# Altium project Casino.PrjPcb
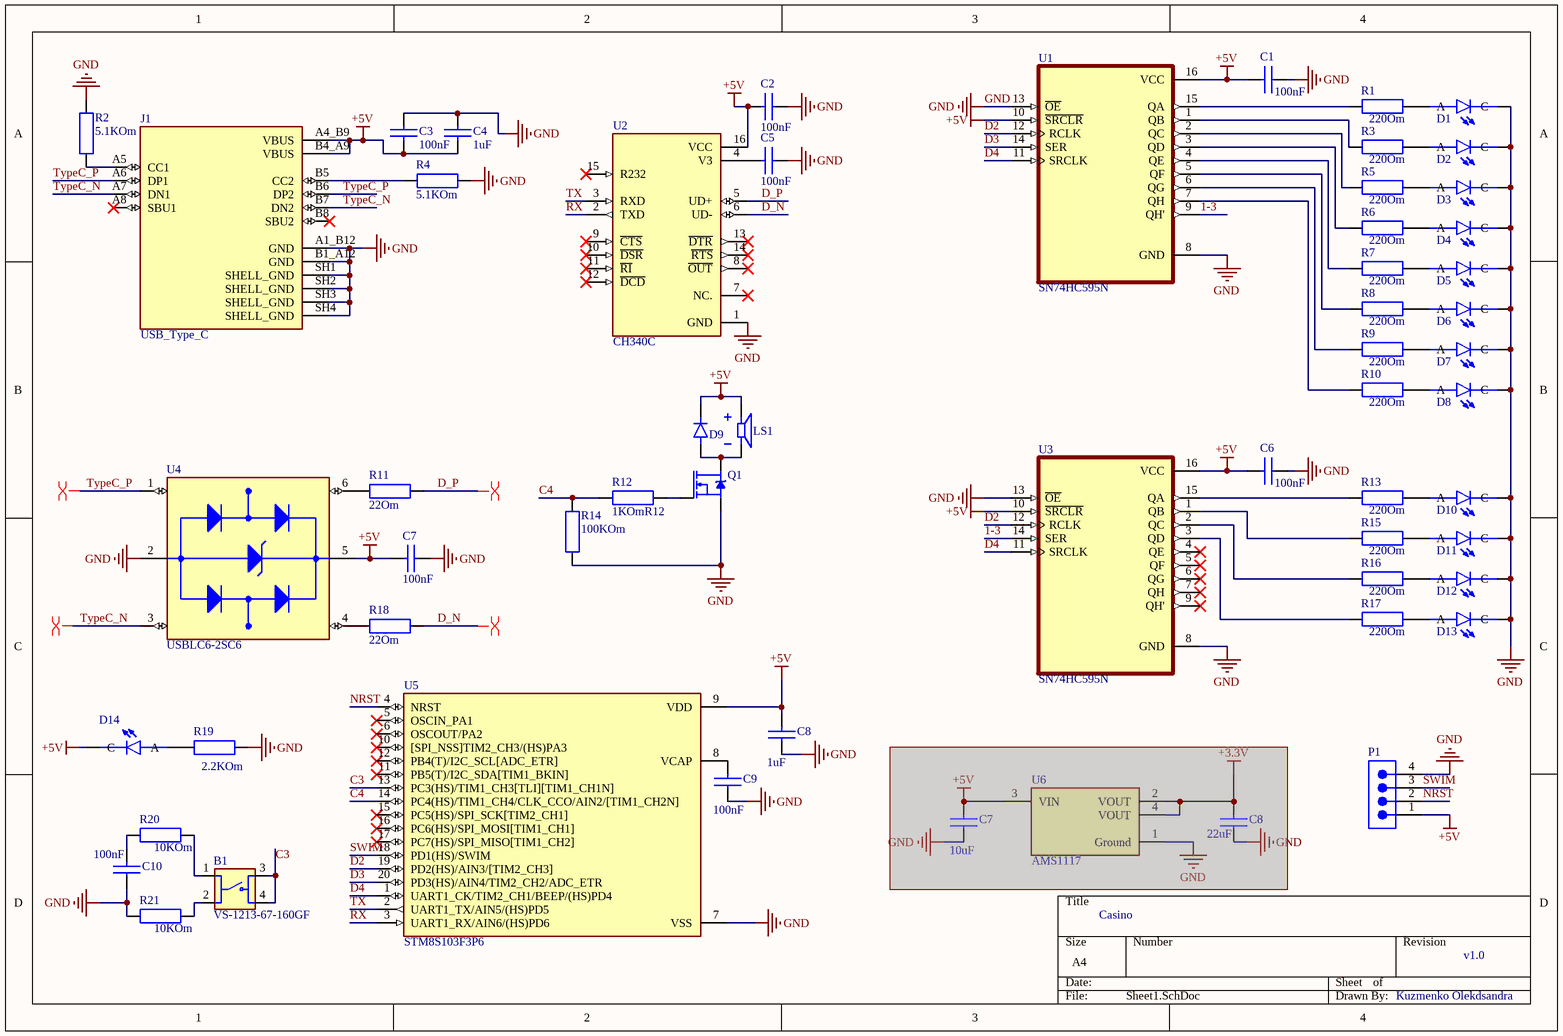
[diagram p0: Sheet1.SchDoc]
1 sheet, 58 parts. Net scope: global (net labels, ports and power ports of the same name join across sheets).
Board file: PCB1.PcbDoc

## Sheet Sheet1.SchDoc
size A4; SheetNumber: 1; SheetTotal: 1

### Parts
(Parts that share a designator on the sheet are numbered #1, #2 ... from top to bottom, then left to right.)
B1  VS-1213-67-160GF  [Button]
C1  value 100nF  [Cap_1206]  (hidden comment: Cap_1206)
C2  value 100nF  [Cap_1206]  (hidden comment: Cap_1206)
C3  value 100nF  [Cap_1206]  (hidden comment: Cap_1206)
C4  value 1uF  [Cap_1206]  (hidden comment: Cap_1206)
C5  value 100nF  [Cap_1206]  (hidden comment: Cap_1206)
C6  100nF  [Cap_1206]
C7#1  value 100nF  [Cap_1206]  (hidden comment: Cap_1206)
C7#2  value 10uF  [Cap_1206]  (hidden comment: Cap_1206)  (masked out: inside a compile mask, not in the netlist)
C8#1  value 1uF  [Cap_1206]  (hidden comment: Cap_1206)
C8#2  value 22uF  [Cap_1206]  (hidden comment: Cap_1206)  (masked out: inside a compile mask, not in the netlist)
C9  value 100nF  [Cap_1206]  (hidden comment: Cap_1206)
C10  value 100nF  [Cap_1206]  (hidden comment: Cap_1206)
D1  Diode  [Diode_Green]  (value not drawn)
D2  Diode  [Diode_Green]  (value not drawn)
D3  Diode  [Diode_Green]  (value not drawn)
D4  Diode  [Diode_Green]  (value not drawn)
D5  Diode  [Diode_Green]  (value not drawn)
D6  Diode  [Diode_Green]  (value not drawn)
D7  Diode  [Diode_Green]  (value not drawn)
D8  Diode  [Diode_Green]  (value not drawn)
D9  Diode standart  [Diode standart]  (value not drawn)
D10  Diode  [Diode_Green]  (value not drawn)
D11  Diode  [Diode_Green]  (value not drawn)
D12  Diode  [Diode_Green]  (value not drawn)
D13  Diode  [Diode_Green]  (value not drawn)
D14  Diode  [Diode_Green]  (value not drawn)
J1  USB_Type_C  [USB_Type_C]
LS1  Speaker  [Speaker]  (value not drawn)
P1  Conector_4pin  [Conector_4pins]  (value not drawn)
Q1  IRLR2905TRPBF  [IRLR2905TRPBF]  (value not drawn)
R1  value 220Om  [Res_1206]  (hidden comment: Res_1206)
R2  value 5.1KOm  [Res_1206]  (hidden comment: Res_1206)
R3  value 220Om  [Res_1206]  (hidden comment: Res_1206)
R4  value 5.1KOm  [Res_1206]  (hidden comment: Res_1206)
R5  value 220Om  [Res_1206]  (hidden comment: Res_1206)
R6  value 220Om  [Res_1206]  (hidden comment: Res_1206)
R7  value 220Om  [Res_1206]  (hidden comment: Res_1206)
R8  value 220Om  [Res_1206]  (hidden comment: Res_1206)
R9  value 220Om  [Res_1206]  (hidden comment: Res_1206)
R10  value 220Om  [Res_1206]  (hidden comment: Res_1206)
R11  value 22Om  [Res_1206]  (hidden comment: Res_1206)
R12  value 1KOmR12  [Res_1206]  (hidden comment: Res_1206)
R13  value 220Om  [Res_1206]  (hidden comment: Res_1206)
R14  value 100KOm  [Res_1206]  (hidden comment: Res_1206)
R15  value 220Om  [Res_1206]  (hidden comment: Res_1206)
R16  value 220Om  [Res_1206]  (hidden comment: Res_1206)
R17  value 220Om  [Res_1206]  (hidden comment: Res_1206)
R18  value 22Om  [Res_1206]  (hidden comment: Res_1206)
R19  value 2.2KOm  [Res_1206]  (hidden comment: Res_1206)
R20  value 10KOm  [Res_1206]  (hidden comment: Res_1206)
R21  value 10KOm  [Res_1206]  (hidden comment: Res_1206)
U1  SN74HC595N  [SN74HC595N]
U2  CH340С  [CH340С]
U3  SN74HC595N  [SN74HC595N]
U4  USBLC6-2SC6  [USBLC6-2SC6]
U5  STM8S103F3P6  [SOP65P640X120-20N]
U6  AMS1117  [AMS1117_SOT223]  (masked out: inside a compile mask, not in the netlist)

### Nets
+5V: C1.2 C2.2 C3.2 C4.2 C6.2 C7#1.2 C8#1.2 D9.C(K) D14.C J1.A4_B9(VBUS) J1.B4_A9(VBUS) LS1.P P1.1 U1.10(~{SRCLR}) U1.16(VCC) U2.16(VCC) U3.10(~{SRCLR}) U3.16(VCC) U4.5(VBUS) U5.9(VDD)
GND: C1.1 C2.1 C3.1 C4.1 C5.1 C6.1 C7#1.1 C8#1.1 C9.1 C10.1 D1.C D2.C D3.C D4.C D5.C D6.C D7.C D8.C D10.C D11.C D12.C D13.C J1.A1_B12(GND) J1.B1_A12(GND) J1.SH1(SHELL_GND) J1.SH2(SHELL_GND) J1.SH3(SHELL_GND) J1.SH4(SHELL_GND) P1.4 Q1.3(S) R2.2 R4.1 R14.1 R19.2 R21.1 U1.8(GND) U1.13(~{OE}) U2.1(GND) U3.8(GND) U3.13(~{OE}) U4.2(GND) U5.7(VSS)
1-3: U1.9(QH') U3.14(SER)
C3: B1.3 B1.4 U5.13(PC3(HS)/TIM1_CH3[TLI][TIM1_CH1N])
C4: R12.2 R14.2 U5.14(PC4(HS)/TIM1_CH4/CLK_CCO/AIN2/[TIM1_CH2N])
D2: U1.12(RCLK) U3.12(RCLK) U5.19(PD2(HS)/AIN3/[TIM2_CH3])
D3: U1.14(SER) U5.20(PD3(HS)/AIN4/TIM2_CH2/ADC_ETR)
D4: U1.11(SRCLK) U3.11(SRCLK) U5.1(UART1_CK/TIM2_CH1/BEEP/(HS)PD4)
D_N: R18.1 U2.6(UD-)
D_P: R11.1 U2.5(UD+)
NRST: P1.2 U5.4(NRST)
RX: U2.2(TXD) U5.3(UART1_RX/AIN6/(HS)PD6)
SWIM: P1.3 U5.18(PD1(HS)/SWIM)
TX: U2.3(RXD) U5.2(UART1_TX/AIN5/(HS)PD5)
TypeC_N: J1.A7(DN1) J1.B7(DN2) U4.3(I/O2_IN)
TypeC_P: J1.A6(DP1) J1.B6(DP2) U4.1(I/O1_IN)
NetB1_1: B1.1 R20.2
NetB1_2: B1.2 R21.2
NetC5_2: C5.2 U2.4(V3)
NetC9_2: C9.2 U5.8(VCAP)
NetC10_2: C10.2 R20.1
NetD1_A: D1.A R1.2
NetD2_A: D2.A R3.2
NetD3_A: D3.A R5.2
NetD4_A: D4.A R6.2
NetD5_A: D5.A R7.2
NetD6_A: D6.A R8.2
NetD7_A: D7.A R9.2
NetD8_A: D8.A R10.2
NetD9_A: D9.A LS1.N Q1.2(D) Q1.PAD(D)
NetD10_A: D10.A R13.2
NetD11_A: D11.A R15.2
NetD12_A: D12.A R16.2
NetD13_A: D13.A R17.2
NetD14_A: D14.A R19.1
NetJ1_A5: J1.A5(CC1) R2.1
NetJ1_B5: J1.B5(CC2) R4.2
NetQ1_1: Q1.1(G) R12.1
NetR1_1: R1.1 U1.15(QA)
NetR3_1: R3.1 U1.1(QB)
NetR5_1: R5.1 U1.2(QC)
NetR6_1: R6.1 U1.3(QD)
NetR7_1: R7.1 U1.4(QE)
NetR8_1: R8.1 U1.5(QF)
NetR9_1: R9.1 U1.6(QG)
NetR10_1: R10.1 U1.7(QH)
NetR11_2: R11.2 U4.6(I/O1_OUT)
NetR13_1: R13.1 U3.15(QA)
NetR15_1: R15.1 U3.1(QB)
NetR16_1: R16.1 U3.2(QC)
NetR17_1: R17.1 U3.3(QD)
NetR18_2: R18.2 U4.4(I/O2_OUT)

Not connected (* = marked no-connect by the designer): J1 A8(SBU1)* B8(SBU2)*; U2 7(NC.)* 8(~{OUT})* 9(~{CTS})* 10(~{DSR})* 11(~{RI})* 12(~{DCD})* 13(~{DTR})* 14(~{RTS})* 15(R232)*; U3 4(QE)* 5(QF)* 6(QG)* 7(QH)* 9(QH')*; U5 5(OSCIN_PA1)* 6(OSCOUT/PA2)* 10([SPI_NSS]TIM2_CH3/(HS)PA3)* 11(PB5(T)/I2C_SDA[TIM1_BKIN])* 12(PB4(T)/I2C_SCL[ADC_ETR])* 15(PC5(HS)/SPI_SCK[TIM2_CH1])* 16(PC6(HS)/SPI_MOSI[TIM1_CH1])* 17(PC7(HS)/SPI_MISO[TIM1_CH2])*

### Layout directives
differential pair: D_N, D_P, TypeC_N, TypeC_P

### Notes on the sheet
- Casino
- v1.0
- Kuzmenko Olekdsandra

### Library data of the parts
B1 = VS-1213-67-160GF: Button 12*12mm
C6 = Cap_1206: Value: 100nF